# Altium project SPT3G_LCBoard.PrjPcb
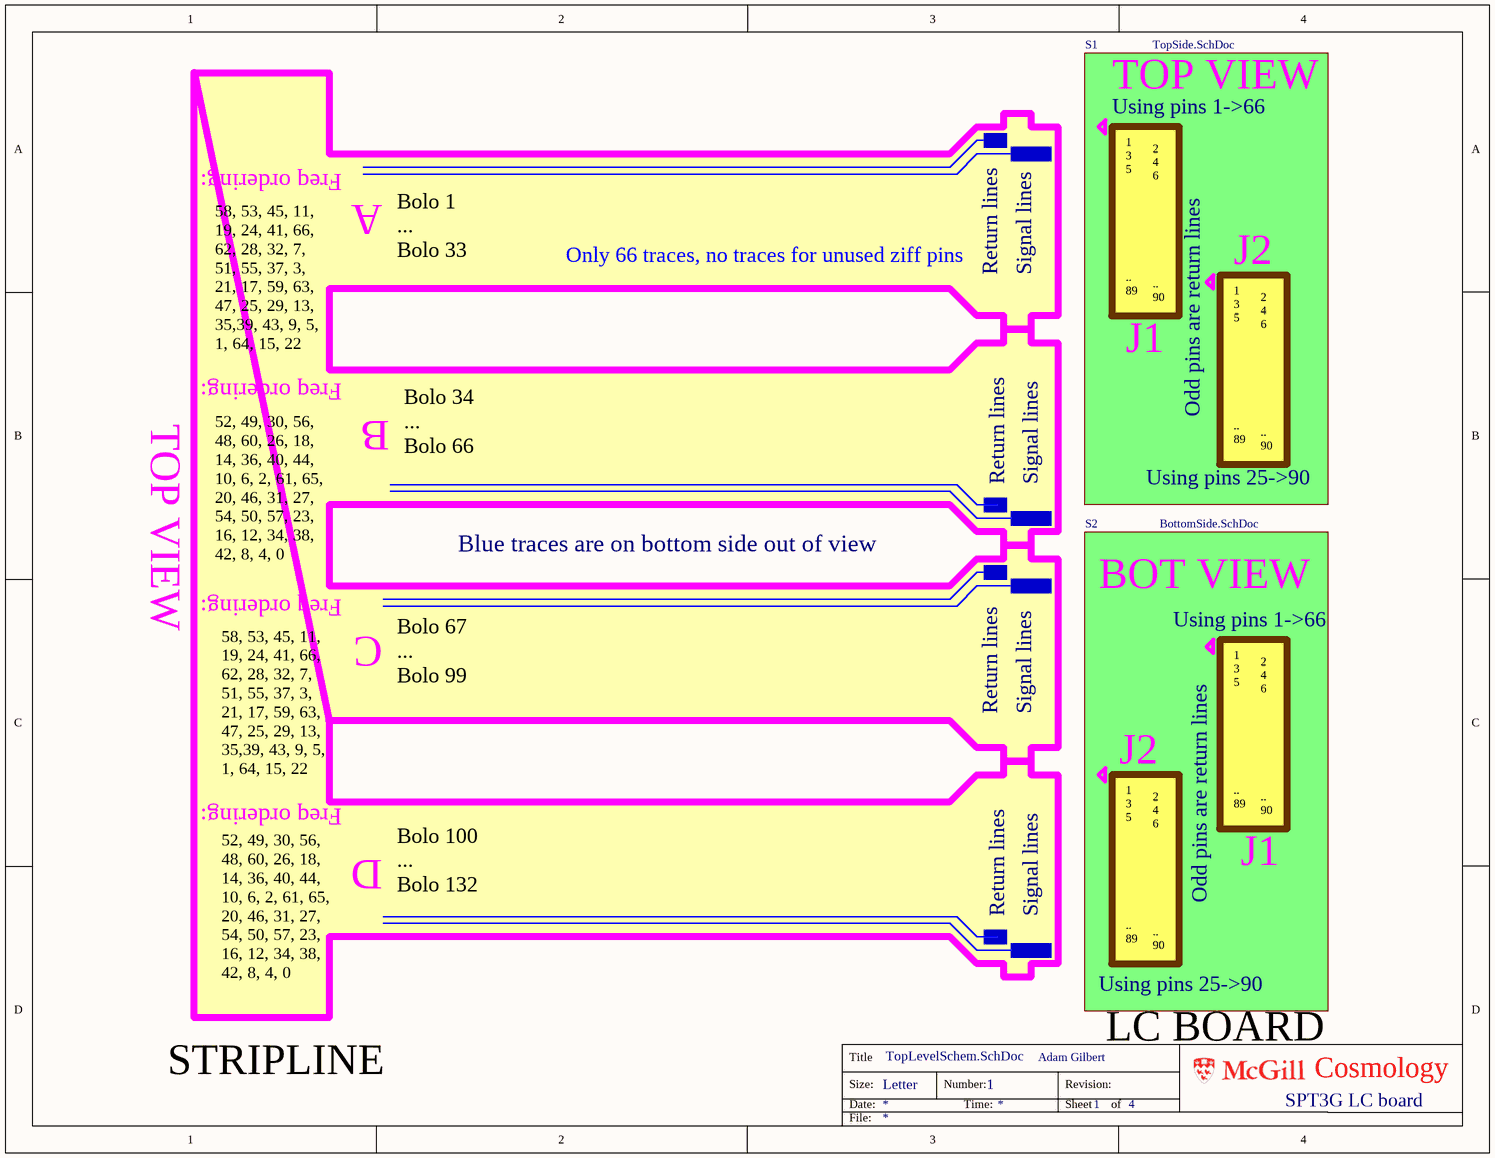
[diagram p0: TopLevelSchem.SchDoc]
ProjectTitle: SPT3G LC board; DrawnBy: Adam Gilbert & Amy Bender
4 sheets, 44 parts. Net scope: flat (ports and power ports of the same name join across sheets).
Board file: SPT3G_LCBoard.PcbDoc
Sheets:
  TopLevelSchem.SchDoc
    S1 = TopSide.SchDoc
      A = LCs.SchDoc
    S2 = BottomSide.SchDoc
      B = LCs.SchDoc

## Sheet TopLevelSchem.SchDoc
size Letter; DrawnBy: Adam Gilbert; Organization: Altium Limited; Address1: L3, 12a Rodborough Rd; Address2: Frenchs Forest; Address3: NSW; Address4: Australia 2086; DocumentNumber: 1; SheetNumber: 1; SheetTotal: 4

### Sub-sheets
S1 = TopSide.SchDoc: no entries
S2 = BottomSide.SchDoc: no entries

### Notes on the sheet
- TOP VIEW
- Freq ordering:
- Using pins 1->66
- A
- Bolo 1
  ...
  Bolo 33
- Only 66 traces, no traces for unused ziff pins
- Return lines
- Signal lines
- J2
- 58, 53, 45, 11, 19, 24, 41, 66, 62, 28, 32, 7, 51, 55, 37, 3, 21, 17, 59, 63, 47, 25, 29, 13, 35,39, 43, 9, 5, 1, 64, 15, 22
- 1
  3
  5
  ..
  89
- J1
- 2
  4
  6
  ..
  90
- B
- Odd pins are return lines
- Bolo 34
  ...
  Bolo 66
- Using pins 25->90
- Blue traces are on bottom side out of view
- 52, 49, 30, 56, 48, 60, 26, 18, 14, 36, 40, 44, 10, 6, 2, 61, 65, 20, 46, 31, 27, 54, 50, 57, 23, 16, 12, 34, 38, 42, 8, 4, 0
- C
- BOT VIEW
- Bolo 67
  ...
  Bolo 99
- D
- Bolo 100
  ...
  Bolo 132
- LC BOARD
- STRIPLINE
- Title
- Size:
- Date:
- Letter
- Number:
- Time:
- Revision:
- Sheet
- of
- Cosmology
- File:

## Sheet TopSide.SchDoc
size Letter; DrawnBy: Adam Gilbert; Organization: Altium Limited; Address1: L3, 12a Rodborough Rd; Address2: Frenchs Forest; Address3: NSW; Address4: Australia 2086; DocumentNumber: 2; SheetNumber: 2; SheetTotal: 4
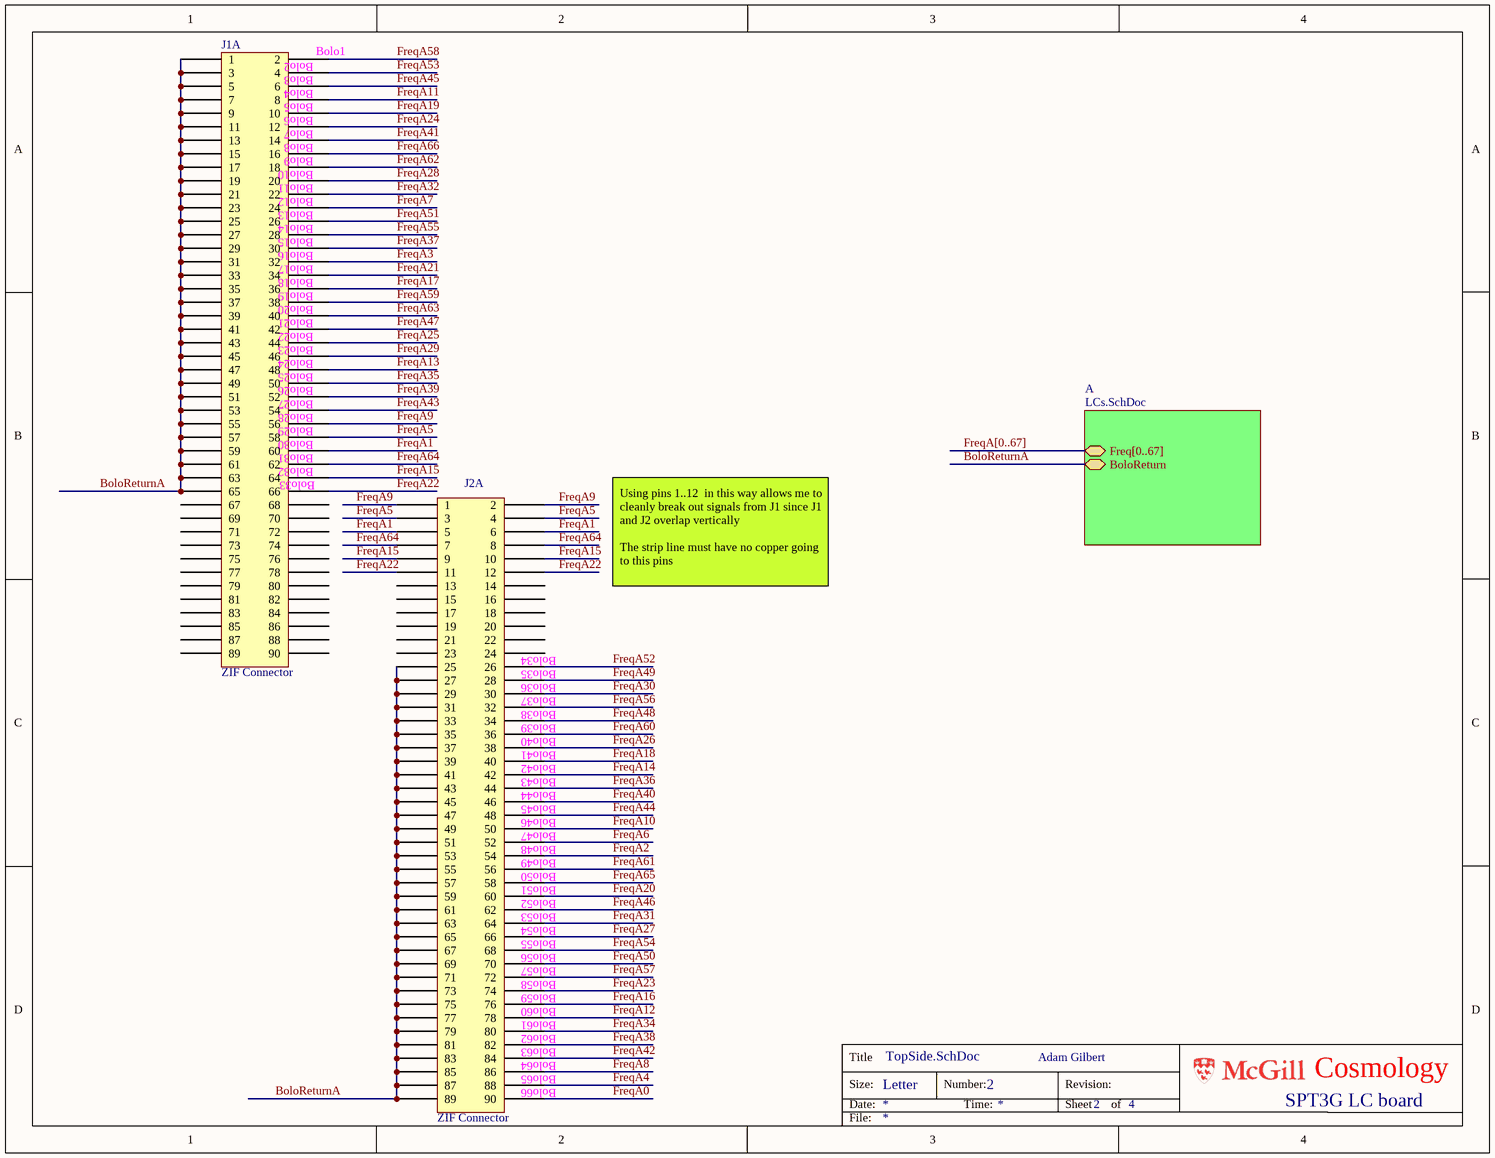
[diagram p1: TopSide.SchDoc]

### Parts
J1A  ZIF Connector  [LCBoard_ZIFCon]
J2A  ZIF Connector  [LCBoard_ZIFCon]

### Sub-sheets
A = LCs.SchDoc: Freq[0..67], BoloReturn

### Nets
BoloReturnA: J1A.1 J1A.3 J1A.5 J1A.7 J1A.9 J1A.11 J1A.13 J1A.15 J1A.17 J1A.19 J1A.21 J1A.23 J1A.25 J1A.27 J1A.29 J1A.31 J1A.33 J1A.35 J1A.37 J1A.39 J1A.41 J1A.43 J1A.45 J1A.47 J1A.49 J1A.51 J1A.53 J1A.55 J1A.57 J1A.59 J1A.61 J1A.63 J1A.65 J2A.25 J2A.27 J2A.29 J2A.31 J2A.33 J2A.35 J2A.37 J2A.39 J2A.41 J2A.43 J2A.45 J2A.47 J2A.49 J2A.51 J2A.53 J2A.55 J2A.57 J2A.59 J2A.61 J2A.63 J2A.65 J2A.67 J2A.69 J2A.71 J2A.73 J2A.75 J2A.77 J2A.79 J2A.81 J2A.83 J2A.85 J2A.87 J2A.89 ; sheet A/BoloReturn
FreqA0: J2A.90
FreqA1: J1A.60 J2A.5 J2A.6
FreqA2: J2A.54
FreqA3: J1A.32
FreqA4: J2A.88
FreqA5: J1A.58 J2A.3 J2A.4
FreqA6: J2A.52
FreqA7: J1A.24
FreqA8: J2A.86
FreqA9: J1A.56 J2A.1 J2A.2
FreqA10: J2A.50
FreqA11: J1A.8
FreqA12: J2A.78
FreqA13: J1A.48
FreqA14: J2A.42
FreqA15: J1A.64 J2A.9 J2A.10
FreqA16: J2A.76
FreqA17: J1A.36
FreqA18: J2A.40
FreqA19: J1A.10
FreqA20: J2A.60
FreqA21: J1A.34
FreqA22: J1A.66 J2A.11 J2A.12
FreqA23: J2A.74
FreqA24: J1A.12
FreqA25: J1A.44
FreqA26: J2A.38
FreqA27: J2A.66
FreqA28: J1A.20
FreqA29: J1A.46
FreqA30: J2A.30
FreqA31: J2A.64
FreqA32: J1A.22
FreqA34: J2A.80
FreqA35: J1A.50
FreqA36: J2A.44
FreqA37: J1A.30
FreqA38: J2A.82
FreqA39: J1A.52
FreqA40: J2A.46
FreqA41: J1A.14
FreqA42: J2A.84
FreqA43: J1A.54
FreqA44: J2A.48
FreqA45: J1A.6
FreqA46: J2A.62
FreqA47: J1A.42
FreqA48: J2A.34
FreqA49: J2A.28
FreqA50: J2A.70
FreqA51: J1A.26
FreqA52: J2A.26
FreqA53: J1A.4
FreqA54: J2A.68
FreqA55: J1A.28
FreqA56: J2A.32
FreqA57: J2A.72
FreqA58: J1A.2
FreqA59: J1A.38
FreqA60: J2A.36
FreqA61: J2A.56
FreqA62: J1A.18
FreqA63: J1A.40
FreqA64: J1A.62 J2A.7 J2A.8
FreqA65: J2A.58
FreqA66: J1A.16

Not connected (* = marked no-connect by the designer): J1A 67 68 69 70 71 72 73 74 75 76 77 78 79 80 81 82 83 84 85 86 87 88 89 90; J2A 13 14 15 16 17 18 19 20 21 22 23 24

### Buses and harness runs
bus FreqA[0..67] = sheet A/Freq[0..67]

### Notes on the sheet
- (near J1A) Bolo2
- (near J1A) Bolo3
- (near J1A) Bolo4
- (near J1A) Bolo5
- (near J1A) Bolo1
- (near J1A) Bolo6
- (near J1A) Bolo7
- (near J1A) Bolo8
- (near J1A) Bolo9
- (near J1A) Bolo10
- (near J1A) Bolo11
- (near J1A) Bolo12
- (near J1A) Bolo13
- (near J1A) Bolo14
- (near J1A) Bolo15
- (near J1A) Bolo16
- (near J1A) Bolo17
- (near J1A) Bolo18
- (near J1A) Bolo19
- (near J1A) Bolo20
- (near J1A) Bolo21
- (near J1A) Bolo22
- (near J1A) Bolo23
- (near J1A) Bolo24
- (near J1A) Bolo25
- (near J1A) Bolo26
- (near J1A) Bolo27
- (near J1A) Bolo28
- (near J1A) Bolo29
- (near J1A) Bolo30
- (near J1A) Bolo31
- (near J1A) Bolo32
- (near J1A) Bolo33
- Using pins 1..12  in this way allows me to cleanly break out signals from J1 since J1 and J2 overlap vertically
  The strip line must have no copper going to this pins
- (near J2A) Bolo34
- (near J2A) Bolo35
- (near J2A) Bolo36
- (near J2A) Bolo37
- (near J2A) Bolo38
- (near J2A) Bolo39
- (near J2A) Bolo40
- (near J2A) Bolo41
- (near J2A) Bolo42
- (near J2A) Bolo43
- (near J2A) Bolo44
- (near J2A) Bolo45
- (near J2A) Bolo46
- (near J2A) Bolo47
- (near J2A) Bolo48
- (near J2A) Bolo49
- (near J2A) Bolo50
- (near J2A) Bolo51
- (near J2A) Bolo52
- (near J2A) Bolo53
- (near J2A) Bolo54
- (near J2A) Bolo55
- (near J2A) Bolo56
- (near J2A) Bolo57
- (near J2A) Bolo58
- (near J2A) Bolo59
- (near J2A) Bolo60
- (near J2A) Bolo61
- (near J2A) Bolo62
- (near J2A) Bolo63
- (near J2A) Bolo64
- (near J2A) Bolo65
- (near J2A) Bolo66
- Title
- Size:
- Date:
- Letter
- Number:
- Time:
- Revision:
- Sheet
- of
- Cosmology
- File:

### Library data of the parts
J1A J2A = LCboard_FH16-90S-0.3SHW(05)

## Sheet LCs.SchDoc
size Letter; DrawnBy: Adam Gilbert; Organization: Altium Limited; Address1: L3, 12a Rodborough Rd; Address2: Frenchs Forest; Address3: NSW; Address4: Australia 2086; DocumentNumber: 4; SheetNumber: 4; SheetTotal: 4
Used 2 times, as channels S1/A, S2/B. Parts and nets are listed once, with the designators drawn on the sheet.
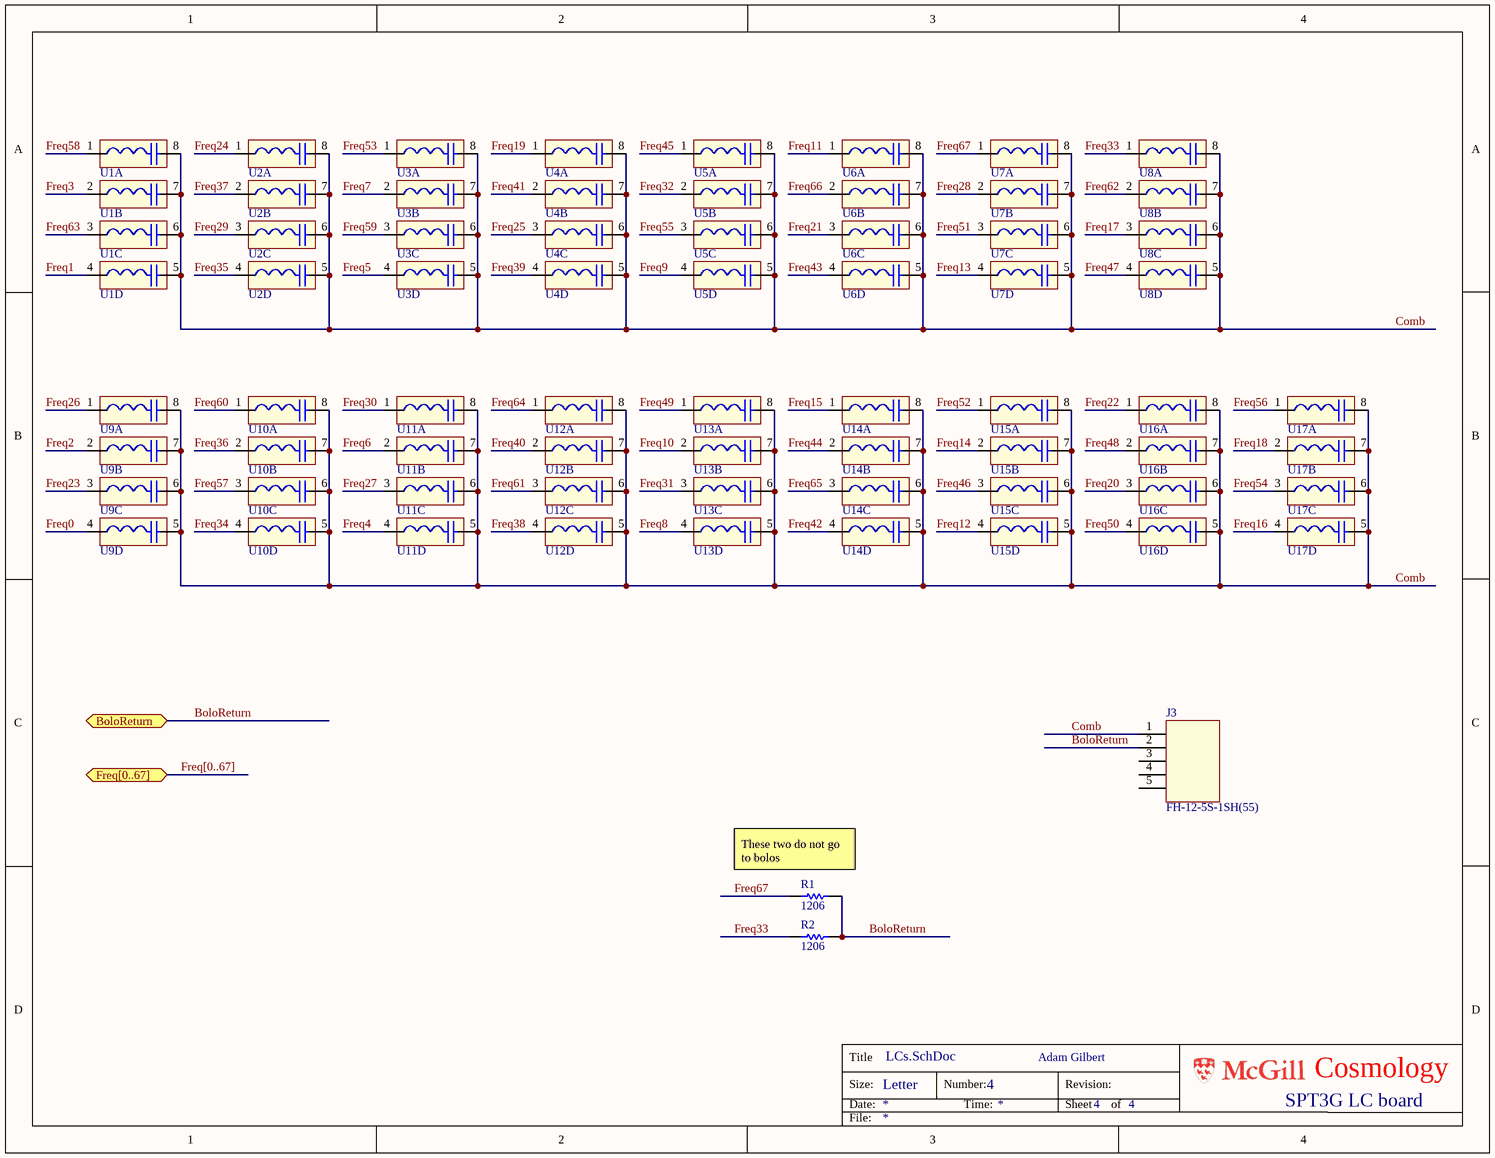
[diagram p2: LCs.SchDoc]

### Parts
J3  FH-12-5S-1SH(55)  [FH-12-5S-1SH(55)]
R1  Res1206  [1206]  (value not drawn)
R2  Res1206  [1206]  (value not drawn)
U1  LC_wafer  [LCCHIP4X2 - BondPads1]  (value not drawn)  (parts A,B,C,D of 4)
U2  LC_wafer  [LCCHIP4X2 - BondPads1]  (value not drawn)  (parts A,B,C,D of 4)
U3  LC_wafer  [LCCHIP4X2 - BondPads1]  (value not drawn)  (parts A,B,C,D of 4)
U4  LC_wafer  [LCCHIP4X2 - BondPads1]  (value not drawn)  (parts A,B,C,D of 4)
U5  LC_wafer  [LCCHIP4X2 - BondPads1]  (value not drawn)  (parts A,B,C,D of 4)
U6  LC_wafer  [LCCHIP4X2 - BondPads1]  (value not drawn)  (parts A,B,C,D of 4)
U7  LC_wafer  [LCCHIP4X2 - BondPads1]  (value not drawn)  (parts A,B,C,D of 4)
U8  LC_wafer  [LCCHIP4X2 - BondPads1]  (value not drawn)  (parts A,B,C,D of 4)
U9  LC_wafer  [LCCHIP4X2 - BondPads1]  (value not drawn)  (parts A,B,C,D of 4)
U10  LC_wafer  [LCCHIP4X2 - BondPads1]  (value not drawn)  (parts A,B,C,D of 4)
U11  LC_wafer  [LCCHIP4X2 - BondPads1]  (value not drawn)  (parts A,B,C,D of 4)
U12  LC_wafer  [LCCHIP4X2 - BondPads1]  (value not drawn)  (parts A,B,C,D of 4)
U13  LC_wafer  [LCCHIP4X2 - BondPads1]  (value not drawn)  (parts A,B,C,D of 4)
U14  LC_wafer  [LCCHIP4X2 - BondPads1]  (value not drawn)  (parts A,B,C,D of 4)
U15  LC_wafer  [LCCHIP4X2 - BondPads1]  (value not drawn)  (parts A,B,C,D of 4)
U16  LC_wafer  [LCCHIP4X2 - BondPads1]  (value not drawn)  (parts A,B,C,D of 4)
U17  LC_wafer  [LCCHIP4X2 - BondPads1]  (value not drawn)  (parts A,B,C,D of 4)

### Ports
BoloReturn, Freq[0..67]

### Nets
BoloReturn: J3.2 R1.2 R2.2 ; port BoloReturn
Comb: J3.1 U1.5 U1.6 U1.7 U1.8 U2.5 U2.6 U2.7 U2.8 U3.5 U3.6 U3.7 U3.8 U4.5 U4.6 U4.7 U4.8 U5.5 U5.6 U5.7 U5.8 U6.5 U6.6 U6.7 U6.8 U7.5 U7.6 U7.7 U7.8 U8.5 U8.6 U8.7 U8.8 U9.5 U9.6 U9.7 U9.8 U10.5 U10.6 U10.7 U10.8 U11.5 U11.6 U11.7 U11.8 U12.5 U12.6 U12.7 U12.8 U13.5 U13.6 U13.7 U13.8 U14.5 U14.6 U14.7 U14.8 U15.5 U15.6 U15.7 U15.8 U16.5 U16.6 U16.7 U16.8 U17.5 U17.6 U17.7 U17.8
Freq0: U9.4
Freq1: U1.4
Freq2: U9.2
Freq3: U1.2
Freq4: U11.4
Freq5: U3.4
Freq6: U11.2
Freq7: U3.2
Freq8: U13.4
Freq9: U5.4
Freq10: U13.2
Freq11: U6.1
Freq12: U15.4
Freq13: U7.4
Freq14: U15.2
Freq15: U14.1
Freq16: U17.4
Freq17: U8.3
Freq18: U17.2
Freq19: U4.1
Freq20: U16.3
Freq21: U6.3
Freq22: U16.1
Freq23: U9.3
Freq24: U2.1
Freq25: U4.3
Freq26: U9.1
Freq27: U11.3
Freq28: U7.2
Freq29: U2.3
Freq30: U11.1
Freq31: U13.3
Freq32: U5.2
Freq33: R2.1 U8.1
Freq34: U10.4
Freq35: U2.4
Freq36: U10.2
Freq37: U2.2
Freq38: U12.4
Freq39: U4.4
Freq40: U12.2
Freq41: U4.2
Freq42: U14.4
Freq43: U6.4
Freq44: U14.2
Freq45: U5.1
Freq46: U15.3
Freq47: U8.4
Freq48: U16.2
Freq49: U13.1
Freq50: U16.4
Freq51: U7.3
Freq52: U15.1
Freq53: U3.1
Freq54: U17.3
Freq55: U5.3
Freq56: U17.1
Freq57: U10.3
Freq58: U1.1
Freq59: U3.3
Freq60: U10.1
Freq61: U12.3
Freq62: U8.2
Freq63: U1.3
Freq64: U12.1
Freq65: U14.3
Freq66: U6.2
Freq67: R1.1 U7.1

Not connected (* = marked no-connect by the designer): J3 3 4 5

### Channels
S1/A: designators end in _A; ports BoloReturn=BoloReturn
S2/B: designators end in _B; ports BoloReturn=BoloReturn

### Buses and harness runs
bus Freq[0..67] = port Freq[0..67]

### Notes on the sheet
- (near R1) These two do not go to bolos
- Title
- Size:
- Date:
- Letter
- Number:
- Time:
- Revision:
- Sheet
- of
- Cosmology
- File:

### Library data of the parts
R1 R2 = Res1206: Resistor; Param1: 100ppm/C; Value: DNL; Param: 1%; TechInfo: *
U1-U17 = LCWafer: Gold bonded integrated LC

## Sheet BottomSide.SchDoc
size Letter; DrawnBy: Adam Gilbert; Organization: Altium Limited; Address1: L3, 12a Rodborough Rd; Address2: Frenchs Forest; Address3: NSW; Address4: Australia 2086; DocumentNumber: 3; SheetNumber: 3; SheetTotal: 4
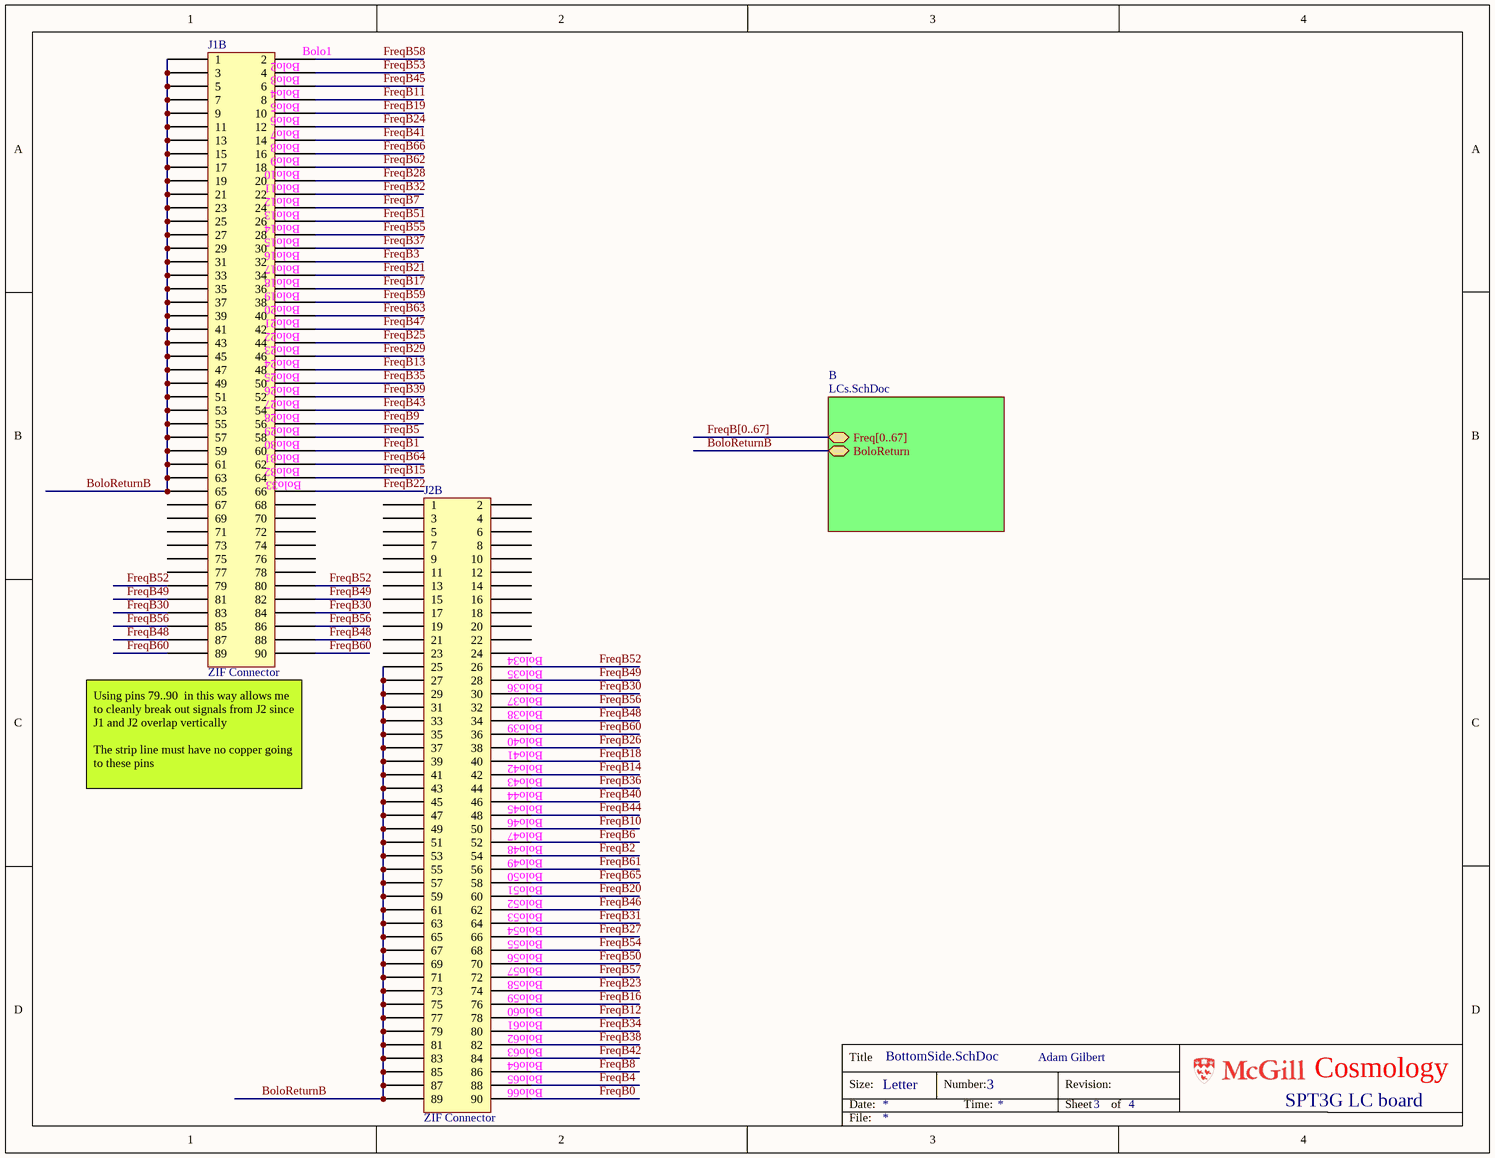
[diagram p3: BottomSide.SchDoc]

### Parts
J1B  ZIF Connector  [LCBoard_ZIFCon]
J2B  ZIF Connector  [LCBoard_ZIFCon]

### Sub-sheets
B = LCs.SchDoc: Freq[0..67], BoloReturn

### Nets
BoloReturnB: J1B.1 J1B.3 J1B.5 J1B.7 J1B.9 J1B.11 J1B.13 J1B.15 J1B.17 J1B.19 J1B.21 J1B.23 J1B.25 J1B.27 J1B.29 J1B.31 J1B.33 J1B.35 J1B.37 J1B.39 J1B.41 J1B.43 J1B.45 J1B.47 J1B.49 J1B.51 J1B.53 J1B.55 J1B.57 J1B.59 J1B.61 J1B.63 J1B.65 J2B.25 J2B.27 J2B.29 J2B.31 J2B.33 J2B.35 J2B.37 J2B.39 J2B.41 J2B.43 J2B.45 J2B.47 J2B.49 J2B.51 J2B.53 J2B.55 J2B.57 J2B.59 J2B.61 J2B.63 J2B.65 J2B.67 J2B.69 J2B.71 J2B.73 J2B.75 J2B.77 J2B.79 J2B.81 J2B.83 J2B.85 J2B.87 J2B.89 ; sheet B/BoloReturn
FreqB0: J2B.90
FreqB1: J1B.60
FreqB2: J2B.54
FreqB3: J1B.32
FreqB4: J2B.88
FreqB5: J1B.58
FreqB6: J2B.52
FreqB7: J1B.24
FreqB8: J2B.86
FreqB9: J1B.56
FreqB10: J2B.50
FreqB11: J1B.8
FreqB12: J2B.78
FreqB13: J1B.48
FreqB14: J2B.42
FreqB15: J1B.64
FreqB16: J2B.76
FreqB17: J1B.36
FreqB18: J2B.40
FreqB19: J1B.10
FreqB20: J2B.60
FreqB21: J1B.34
FreqB22: J1B.66
FreqB23: J2B.74
FreqB24: J1B.12
FreqB25: J1B.44
FreqB26: J2B.38
FreqB27: J2B.66
FreqB28: J1B.20
FreqB29: J1B.46
FreqB30: J1B.83 J1B.84 J2B.30
FreqB31: J2B.64
FreqB32: J1B.22
FreqB34: J2B.80
FreqB35: J1B.50
FreqB36: J2B.44
FreqB37: J1B.30
FreqB38: J2B.82
FreqB39: J1B.52
FreqB40: J2B.46
FreqB41: J1B.14
FreqB42: J2B.84
FreqB43: J1B.54
FreqB44: J2B.48
FreqB45: J1B.6
FreqB46: J2B.62
FreqB47: J1B.42
FreqB48: J1B.87 J1B.88 J2B.34
FreqB49: J1B.81 J1B.82 J2B.28
FreqB50: J2B.70
FreqB51: J1B.26
FreqB52: J1B.79 J1B.80 J2B.26
FreqB53: J1B.4
FreqB54: J2B.68
FreqB55: J1B.28
FreqB56: J1B.85 J1B.86 J2B.32
FreqB57: J2B.72
FreqB58: J1B.2
FreqB59: J1B.38
FreqB60: J1B.89 J1B.90 J2B.36
FreqB61: J2B.56
FreqB62: J1B.18
FreqB63: J1B.40
FreqB64: J1B.62
FreqB65: J2B.58
FreqB66: J1B.16

Not connected (* = marked no-connect by the designer): J1B 67 68 69 70 71 72 73 74 75 76 77 78; J2B 1 2 3 4 5 6 7 8 9 10 11 12 13 14 15 16 17 18 19 20 21 22 23 24

### Buses and harness runs
bus FreqB[0..67] = sheet B/Freq[0..67]

### Notes on the sheet
- (near J1B) Bolo2
- (near J1B) Bolo3
- (near J1B) Bolo4
- (near J1B) Bolo5
- (near J1B) Bolo1
- (near J1B) Bolo6
- (near J1B) Bolo7
- (near J1B) Bolo8
- (near J1B) Bolo9
- (near J1B) Bolo10
- (near J1B) Bolo11
- (near J1B) Bolo12
- (near J1B) Bolo13
- (near J1B) Bolo14
- (near J1B) Bolo15
- (near J1B) Bolo16
- (near J1B) Bolo17
- (near J1B) Bolo18
- (near J1B) Bolo19
- (near J1B) Bolo20
- (near J1B) Bolo21
- (near J1B) Bolo22
- (near J1B) Bolo23
- (near J1B) Bolo24
- (near J1B) Bolo25
- (near J1B) Bolo26
- (near J1B) Bolo27
- (near J1B) Bolo28
- (near J1B) Bolo29
- (near J1B) Bolo30
- (near J1B) Bolo31
- (near J1B) Bolo32
- (near J1B) Bolo33
- (near J2B) Bolo34
- (near J2B) Bolo35
- (near J2B) Bolo36
- (near J2B) Bolo37
- (near J2B) Bolo38
- (near J2B) Bolo39
- (near J2B) Bolo40
- (near J2B) Bolo41
- (near J2B) Bolo42
- (near J2B) Bolo43
- (near J1B) Using pins 79..90  in this way allows me to cleanly break out signals from J2 since J1 and J2 overlap vertically
  The strip line must have no copper going to these pins
- (near J2B) Bolo44
- (near J2B) Bolo45
- (near J2B) Bolo46
- (near J2B) Bolo47
- (near J2B) Bolo48
- (near J2B) Bolo49
- (near J2B) Bolo50
- (near J2B) Bolo51
- (near J2B) Bolo52
- (near J2B) Bolo53
- (near J2B) Bolo54
- (near J2B) Bolo55
- (near J2B) Bolo56
- (near J2B) Bolo57
- (near J2B) Bolo58
- (near J2B) Bolo59
- (near J2B) Bolo60
- (near J2B) Bolo61
- (near J2B) Bolo62
- (near J2B) Bolo63
- (near J2B) Bolo64
- (near J2B) Bolo65
- (near J2B) Bolo66
- Title
- Size:
- Date:
- Letter
- Number:
- Time:
- Revision:
- Sheet
- of
- Cosmology
- File:

### Library data of the parts
J1B J2B = LCboard_FH16-90S-0.3SHW(05)

## Nets that join several sheets
BoloReturn: S1/A (J3_A.2 R1_A.2 R2_A.2), S2/B (J3_B.2 R1_B.2 R2_B.2)
Freq0: S1/A (U9_A.4), S2/B (U9_B.4)
Freq1: S1/A (U1_A.4), S2/B (U1_B.4)
Freq2: S1/A (U9_A.2), S2/B (U9_B.2)
Freq3: S1/A (U1_A.2), S2/B (U1_B.2)
Freq4: S1/A (U11_A.4), S2/B (U11_B.4)
Freq5: S1/A (U3_A.4), S2/B (U3_B.4)
Freq6: S1/A (U11_A.2), S2/B (U11_B.2)
Freq7: S1/A (U3_A.2), S2/B (U3_B.2)
Freq8: S1/A (U13_A.4), S2/B (U13_B.4)
Freq9: S1/A (U5_A.4), S2/B (U5_B.4)
Freq10: S1/A (U13_A.2), S2/B (U13_B.2)
Freq11: S1/A (U6_A.1), S2/B (U6_B.1)
Freq12: S1/A (U15_A.4), S2/B (U15_B.4)
Freq13: S1/A (U7_A.4), S2/B (U7_B.4)
Freq14: S1/A (U15_A.2), S2/B (U15_B.2)
Freq15: S1/A (U14_A.1), S2/B (U14_B.1)
Freq16: S1/A (U17_A.4), S2/B (U17_B.4)
Freq17: S1/A (U8_A.3), S2/B (U8_B.3)
Freq18: S1/A (U17_A.2), S2/B (U17_B.2)
Freq19: S1/A (U4_A.1), S2/B (U4_B.1)
Freq20: S1/A (U16_A.3), S2/B (U16_B.3)
Freq21: S1/A (U6_A.3), S2/B (U6_B.3)
Freq22: S1/A (U16_A.1), S2/B (U16_B.1)
Freq23: S1/A (U9_A.3), S2/B (U9_B.3)
Freq24: S1/A (U2_A.1), S2/B (U2_B.1)
Freq25: S1/A (U4_A.3), S2/B (U4_B.3)
Freq26: S1/A (U9_A.1), S2/B (U9_B.1)
Freq27: S1/A (U11_A.3), S2/B (U11_B.3)
Freq28: S1/A (U7_A.2), S2/B (U7_B.2)
Freq29: S1/A (U2_A.3), S2/B (U2_B.3)
Freq30: S1/A (U11_A.1), S2/B (U11_B.1)
Freq31: S1/A (U13_A.3), S2/B (U13_B.3)
Freq32: S1/A (U5_A.2), S2/B (U5_B.2)
Freq33: S1/A (R2_A.1 U8_A.1), S2/B (R2_B.1 U8_B.1)
Freq34: S1/A (U10_A.4), S2/B (U10_B.4)
Freq35: S1/A (U2_A.4), S2/B (U2_B.4)
Freq36: S1/A (U10_A.2), S2/B (U10_B.2)
Freq37: S1/A (U2_A.2), S2/B (U2_B.2)
Freq38: S1/A (U12_A.4), S2/B (U12_B.4)
Freq39: S1/A (U4_A.4), S2/B (U4_B.4)
Freq40: S1/A (U12_A.2), S2/B (U12_B.2)
Freq41: S1/A (U4_A.2), S2/B (U4_B.2)
Freq42: S1/A (U14_A.4), S2/B (U14_B.4)
Freq43: S1/A (U6_A.4), S2/B (U6_B.4)
Freq44: S1/A (U14_A.2), S2/B (U14_B.2)
Freq45: S1/A (U5_A.1), S2/B (U5_B.1)
Freq46: S1/A (U15_A.3), S2/B (U15_B.3)
Freq47: S1/A (U8_A.4), S2/B (U8_B.4)
Freq48: S1/A (U16_A.2), S2/B (U16_B.2)
Freq49: S1/A (U13_A.1), S2/B (U13_B.1)
Freq50: S1/A (U16_A.4), S2/B (U16_B.4)
Freq51: S1/A (U7_A.3), S2/B (U7_B.3)
Freq52: S1/A (U15_A.1), S2/B (U15_B.1)
Freq53: S1/A (U3_A.1), S2/B (U3_B.1)
Freq54: S1/A (U17_A.3), S2/B (U17_B.3)
Freq55: S1/A (U5_A.3), S2/B (U5_B.3)
Freq56: S1/A (U17_A.1), S2/B (U17_B.1)
Freq57: S1/A (U10_A.3), S2/B (U10_B.3)
Freq58: S1/A (U1_A.1), S2/B (U1_B.1)
Freq59: S1/A (U3_A.3), S2/B (U3_B.3)
Freq60: S1/A (U10_A.1), S2/B (U10_B.1)
Freq61: S1/A (U12_A.3), S2/B (U12_B.3)
Freq62: S1/A (U8_A.2), S2/B (U8_B.2)
Freq63: S1/A (U1_A.3), S2/B (U1_B.3)
Freq64: S1/A (U12_A.1), S2/B (U12_B.1)
Freq65: S1/A (U14_A.3), S2/B (U14_B.3)
Freq66: S1/A (U6_A.2), S2/B (U6_B.2)
Freq67: S1/A (R1_A.1 U7_A.1), S2/B (R1_B.1 U7_B.1)